# EAGLE design +5V_3.3V_+-2.5V_PowerSupply (EAGLE 7.2.0)
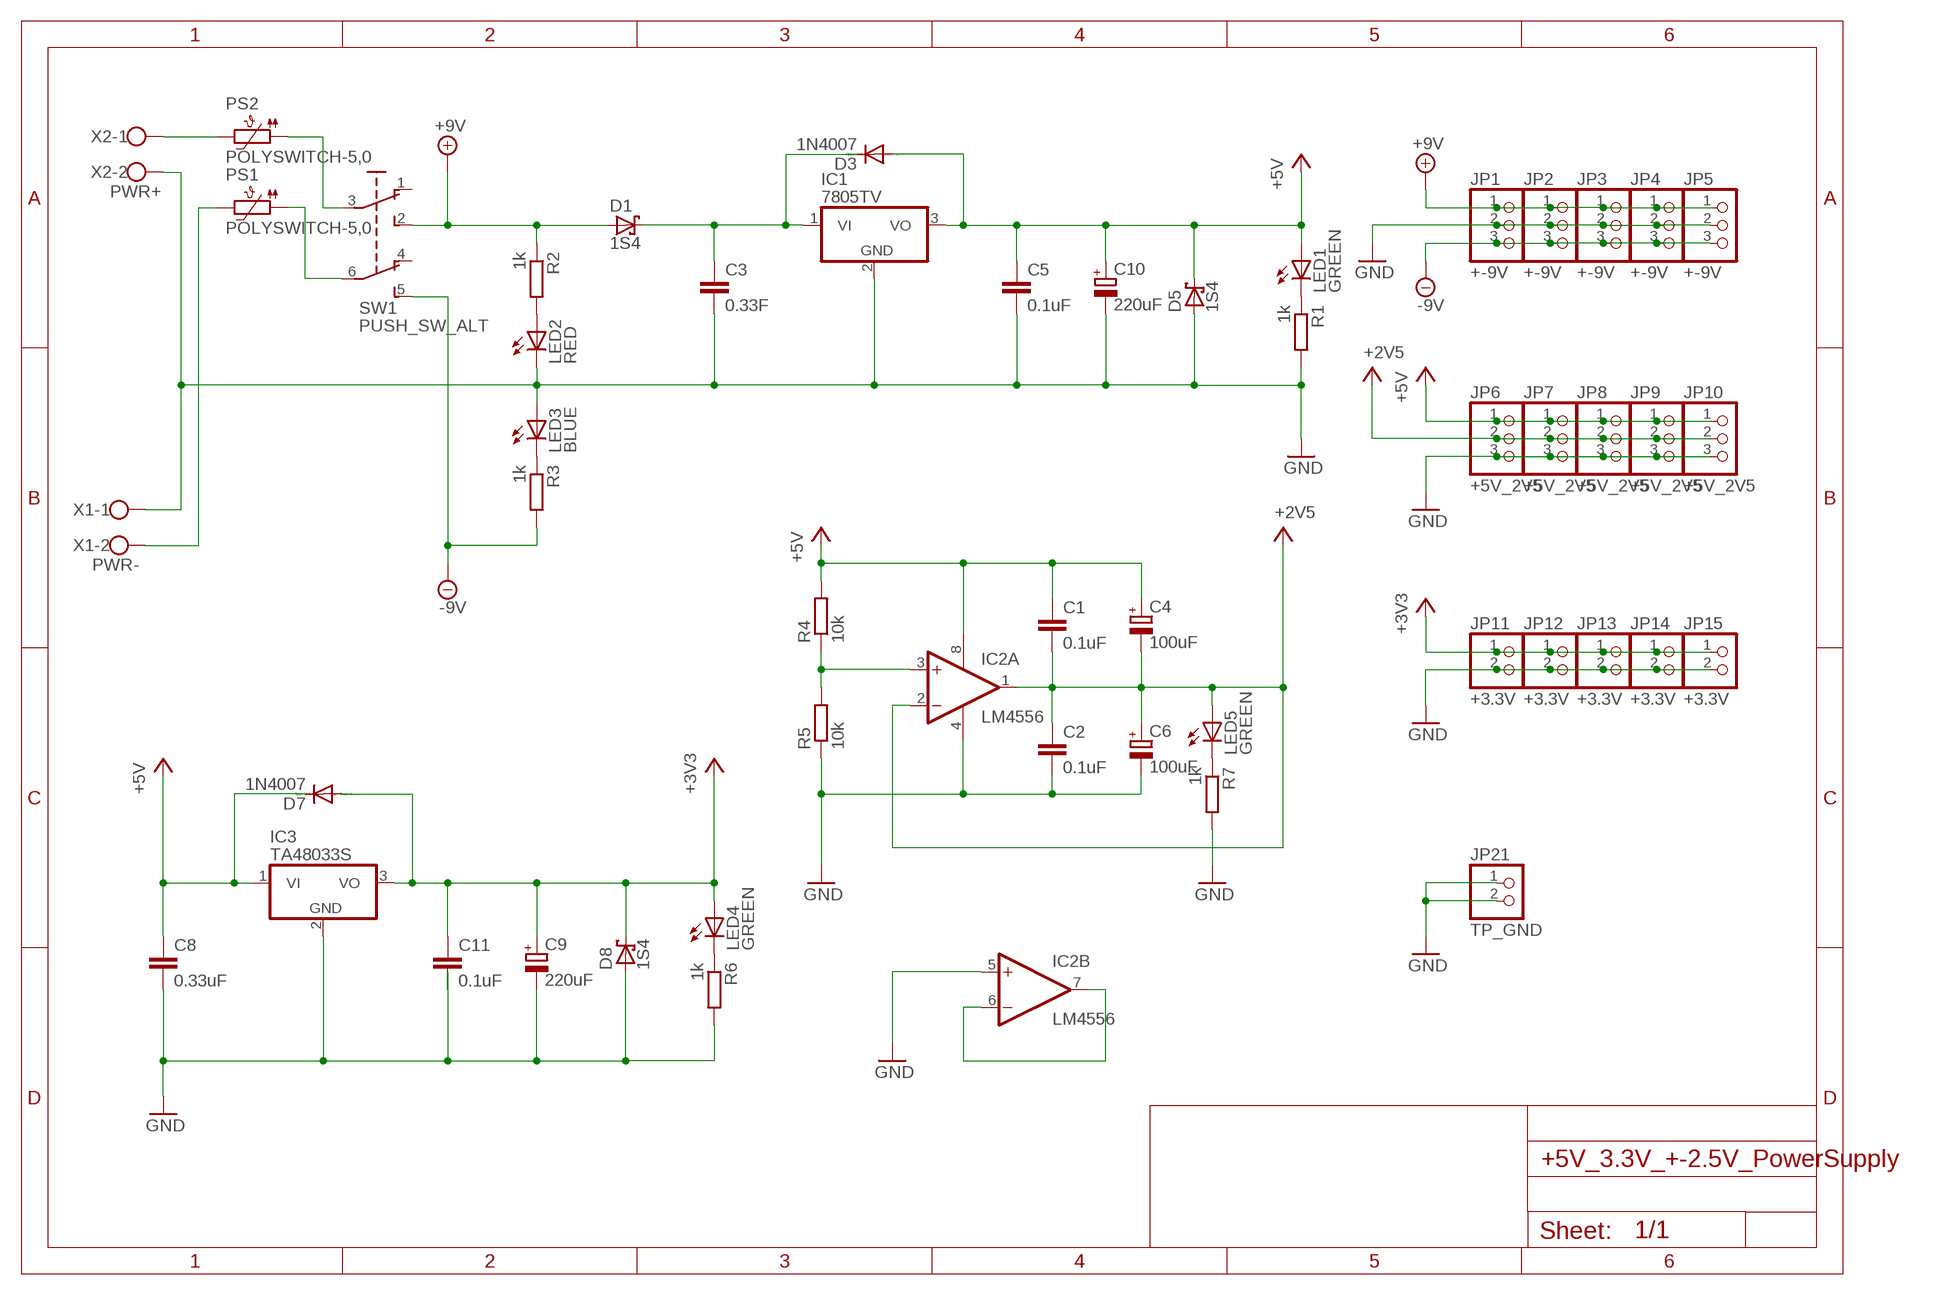
[diagram p0: schematic, sheet 1]

## Parts
C1  0.1uF  C-EU025-024X044  [C025-024X044]
C2  0.1uF  C-EU025-024X044  [C025-024X044]
C3  0.33F  C-EU050-025X075  [C050-025X075]
C4  100uF  CPOL-EUE2.5-6  [E2,5-6]
C5  0.1uF  C-EU025-024X044  [C025-024X044]
C6  100uF  CPOL-EUE2.5-6  [E2,5-6]
C8  0.33uF  C-EU050-025X075  [C050-025X075]
C9  220uF  CPOL-EUE2.5-7  [E2,5-7]
C10  220uF  CPOL-EUE2.5-7  [E2,5-7]
C11  0.1uF  C-EU025-024X044  [C025-024X044]
D1  1S4  SCHOTTKY-DIODEDO35-7  [DO35-7]
D3  1N4007  DIODE-D-7.5  [D-7.5]
D5  1S4  SCHOTTKY-DIODEDO35-7  [DO35-7]
D7  1N4007  DIODE-D-7.5  [D-7.5]
D8  1S4  SCHOTTKY-DIODEDO35-7  [DO35-7]
IC1  7805TV  [TO220V]
IC2  LM4556  LM4558N  [DIL08]
IC3  TA48033S  7805TV  [TO220V]
JP1  +-9V  PINHD-1X3  [1X03]
JP2  +-9V  PINHD-1X3  [1X03]
JP3  +-9V  PINHD-1X3  [1X03]
JP4  +-9V  PINHD-1X3  [1X03]
JP5  +-9V  PINHD-1X3  [1X03]
JP6  +5V_2V5  PINHD-1X3  [1X03]
JP7  +5V_2V5  PINHD-1X3  [1X03]
JP8  +5V_2V5  PINHD-1X3  [1X03]
JP9  +5V_2V5  PINHD-1X3  [1X03]
JP10  +5V_2V5  PINHD-1X3  [1X03]
JP11  +3.3V  PINHD-1X2  [1X02]
JP12  +3.3V  PINHD-1X2  [1X02]
JP13  +3.3V  PINHD-1X2  [1X02]
JP14  +3.3V  PINHD-1X2  [1X02]
JP15  +3.3V  PINHD-1X2  [1X02]
JP21  TP_GND  PINHD-1X2  [1X02]
LED1  GREEN  LED3MM  [LED3MM]
LED2  RED  LED3MM  [LED3MM]
LED3  BLUE  LED3MM  [LED3MM]
LED4  GREEN  LED3MM  [LED3MM]
LED5  GREEN  LED3MM  [LED3MM]
PS1  POLYSWITCH-5,0  [POLYSWITCH-5,0]
PS2  POLYSWITCH-5,0  [POLYSWITCH-5,0]
R1  1k  R-EU_0207/7  [0207/7]
R2  1k  R-EU_0207/7  [0207/7]
R3  1k  R-EU_0207/7  [0207/7]
R4  10k  R-EU_0207/7  [0207/7]
R5  10k  R-EU_0207/7  [0207/7]
R6  1k  R-EU_0207/7  [0207/7]
R7  1k  R-EU_0207/7  [0207/7]
SW1  PUSH_SW_ALT  [PUSH_SW_ALT]
X1  PWR-  W237-102  [W237-102]
X2  PWR+  W237-102  [W237-102]

## Nets
+3V3: C9.+ C11.1 D7.A D8.C IC3.3(VO) JP11.1 JP12.1 JP13.1 JP14.1 JP15.1 LED4.A
+5V: C1.1 C4.+ C5.1 C8.1 C10.+ D3.A D5.C D7.C IC1.3(VO) IC2.8(P:V+) IC3.1(VI) JP6.1 JP7.1 JP8.1 JP9.1 JP10.1 LED1.A R4.2
+9V: D1.A JP1.1 JP2.1 JP3.1 JP4.1 JP5.1 R2.1 SW1.2(S)
-9V: JP1.3 JP2.3 JP3.3 JP4.3 JP5.3 R3.2 SW1.5(S1)
GND: C2.2 C3.2 C5.2 C6.- C8.2 C9.- C10.- C11.2 D5.A D8.A IC1.2(GND) IC2.4(P:V-) IC2.5(B:+IN) IC3.2(GND) JP1.2 JP2.2 JP3.2 JP4.2 JP5.2 JP6.3 JP7.3 JP8.3 JP9.3 JP10.3 JP11.2 JP12.2 JP13.2 JP14.2 JP15.2 JP21.1 JP21.2 LED2.K(C) LED3.A R1.2 R5.1 R6.2 R7.2 X1.1 X2.2
N$1: PS2.2 X2.1
N$2: PS1.1 SW1.6(P1)
N$3: LED1.K(C) R1.1
N$4: LED2.A R2.2
N$5: C3.1 D1.C D3.C IC1.1(VI)
N$6: LED3.K(C) R3.1
N$7: IC2.3(A:+IN) R4.1 R5.2
N$8: LED5.K(C) R7.1
N$9: IC2.6(B:-IN) IC2.7(B:OUT)
N$10: PS1.2 X1.2
N$11: PS2.1 SW1.3(P)
N$12: LED4.K(C) R6.1
V+: C1.2 C2.1 C4.- C6.+ IC2.1(A:OUT) IC2.2(A:-IN) JP6.2 JP7.2 JP8.2 JP9.2 JP10.2 LED5.A ; supply symbol labelled +2V5
Unconnected: SW1.1(O) SW1.4(O1)

## Library data of the parts
C1-C3 C5 C8 C11 = rcl:C-EU: CAPACITOR, European symbol
C4 C6 C9 C10 = rcl:CPOL-EU: POLARIZED CAPACITOR, European symbol
D1 D5 D8 = diode:SCHOTTKY-DIODE: Schottky Diode
D3 D7 = diode:DIODE-: DIODE
IC1 IC3 = linear:78*: Positive VOLTAGE REGULATOR Source: http://cache.national.com/ds/LM/LM78L05.pdf http://www.fairchildsemi.com/ds/LM/LM7805.pdf
IC2 = linear:*4558: OP AMP
JP1-JP10 = pinhead:PINHD-1X3: PIN HEADER
JP11-JP15 JP21 = pinhead:PINHD-1X2: PIN HEADER
LED1-LED5 = led:LED: LED OSRAM: - CHIPLED LG R971, LG N971, LY N971, LG Q971, LY Q971, LO R971, LY R971 LH N974, LH R974 LS Q976, LO Q976, LY Q976 LO Q996 - Hyper CHIPLED LW Q18S LB Q993, LB Q99A, LB R99A - SideLED LS A670, LO A670, LY A670, LG A670, LP A670 LB A673, LV A673, LT A673, LW A673 LH A674 LY A675 LS A676, LA A676, LO A676, LY A676, LW A676 LS A679, LY A679, LG A679 - Hyper Micro SIDELED® LS Y876, LA Y876, LO Y876, LY Y876 LT Y87S - SmartLED LW L88C, LW L88S LB L89C, LB L89S, LG L890 LS L89K, LO L89K, LY L89K LS L896, LA L896, LO L896, LY L896 - TOPLED LS T670, LO T670, LY T670, LG T670, LP T670 LSG T670, LSP T670, LSY T670, LOP T670, LYG T670 LG T671, LOG T671, LSG T671 LB T673, LV T673, LT T673, LW T673 LH T674 LS T676, LA T676, LO T676, LY T676, LB T676, LH T676, LSB T676, LW T676 LB T67C, LV T67C, LT T67C, LS T67K, LO T67K, LY T67K, LW E67C LS E67B, LA E67B, LO E67B, LY E67B, LB E67C, LV E67C, LT E67C LW T67C LS T679, LY T679, LG T679 LS T770, LO T770, LY T770, LG T770, LP T770 LB T773, LV T773, LT T773, LW T773 LH T774 LS E675, LA E675, LY E675, LS T675 LS T776, LA T776, LO T776, LY T776, LB T776 LHGB T686 LT T68C, LB T68C - Hyper Mini TOPLED® LB M676 - Mini TOPLED Santana® LG M470 LS M47K, LO M47K, LY M47K Source: http://www.osram.convergy.de LUXEON: - LUMILED® LXK2-PW12-R00, LXK2-PW12-S00, LXK2-PW14-U00, LXK2-PW14-V00 LXK2-PM12-R00, LXK2-PM12-S00, LXK2-PM14-U00 LXK2-PE12-Q00, LXK2-PE12-R00, LXK2-PE12-S00, LXK2-PE14-T00, LXK2-PE14-U00 LXK2-PB12-K00, LXK2-PB12-L00, LXK2-PB12-M00, LXK2-PB14-N00, LXK2-PB14-P00, LXK2-PB14-Q00 LXK2-PR12-L00, LXK2-PR12-M00, LXK2-PR14-Q00, LXK2-PR14-R00 LXK2-PD12-Q00, LXK2-PD12-R00, LXK2-PD12-S00 LXK2-PH12-R00, LXK2-PH12-S00 LXK2-PL12-P00, LXK2-PL12-Q00, LXK2-PL12-R00 Source: www.luxeon.com KINGBRIGHT: KA-3528ASYC Source: www.kingbright.com
PS1 PS2 = mylib2:POLYSWITCH-5,0
R1-R7 = rcl:R-EU_: RESISTOR, European symbol
SW1 = mylib2:PUSH_SW_ALT
X1 X2 = con-wago-500:W237-102: WAGO SCREW CLAMP; MPN: 237-102; OC_FARNELL: unknown; OC_NEWARK: 70K9898

## Board
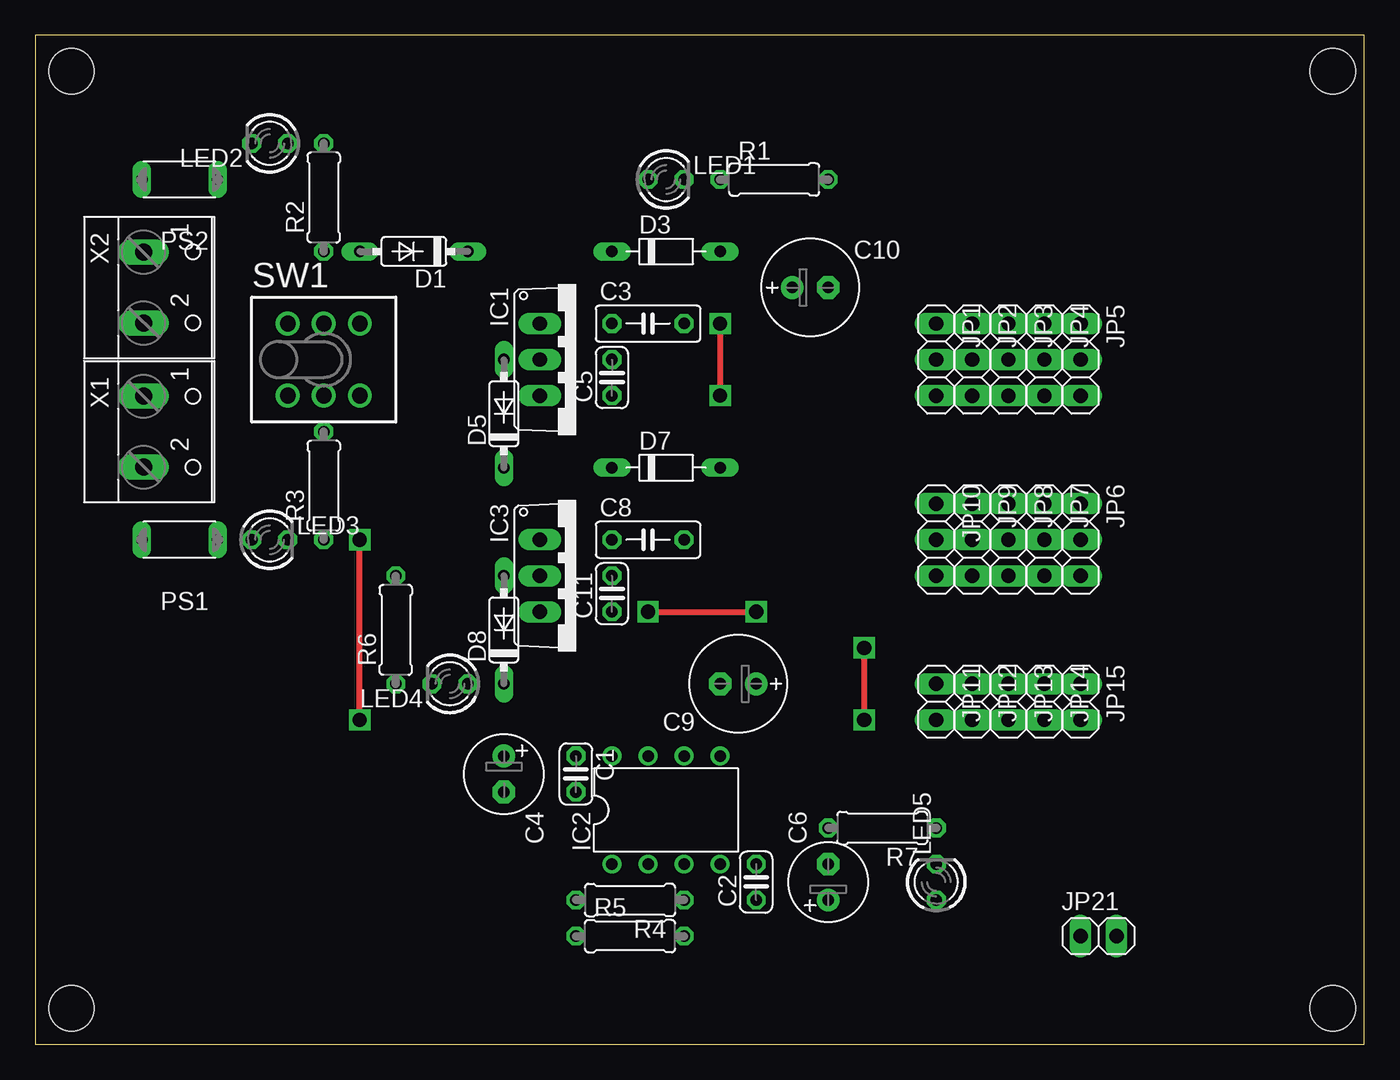
[diagram p1: board, top side]
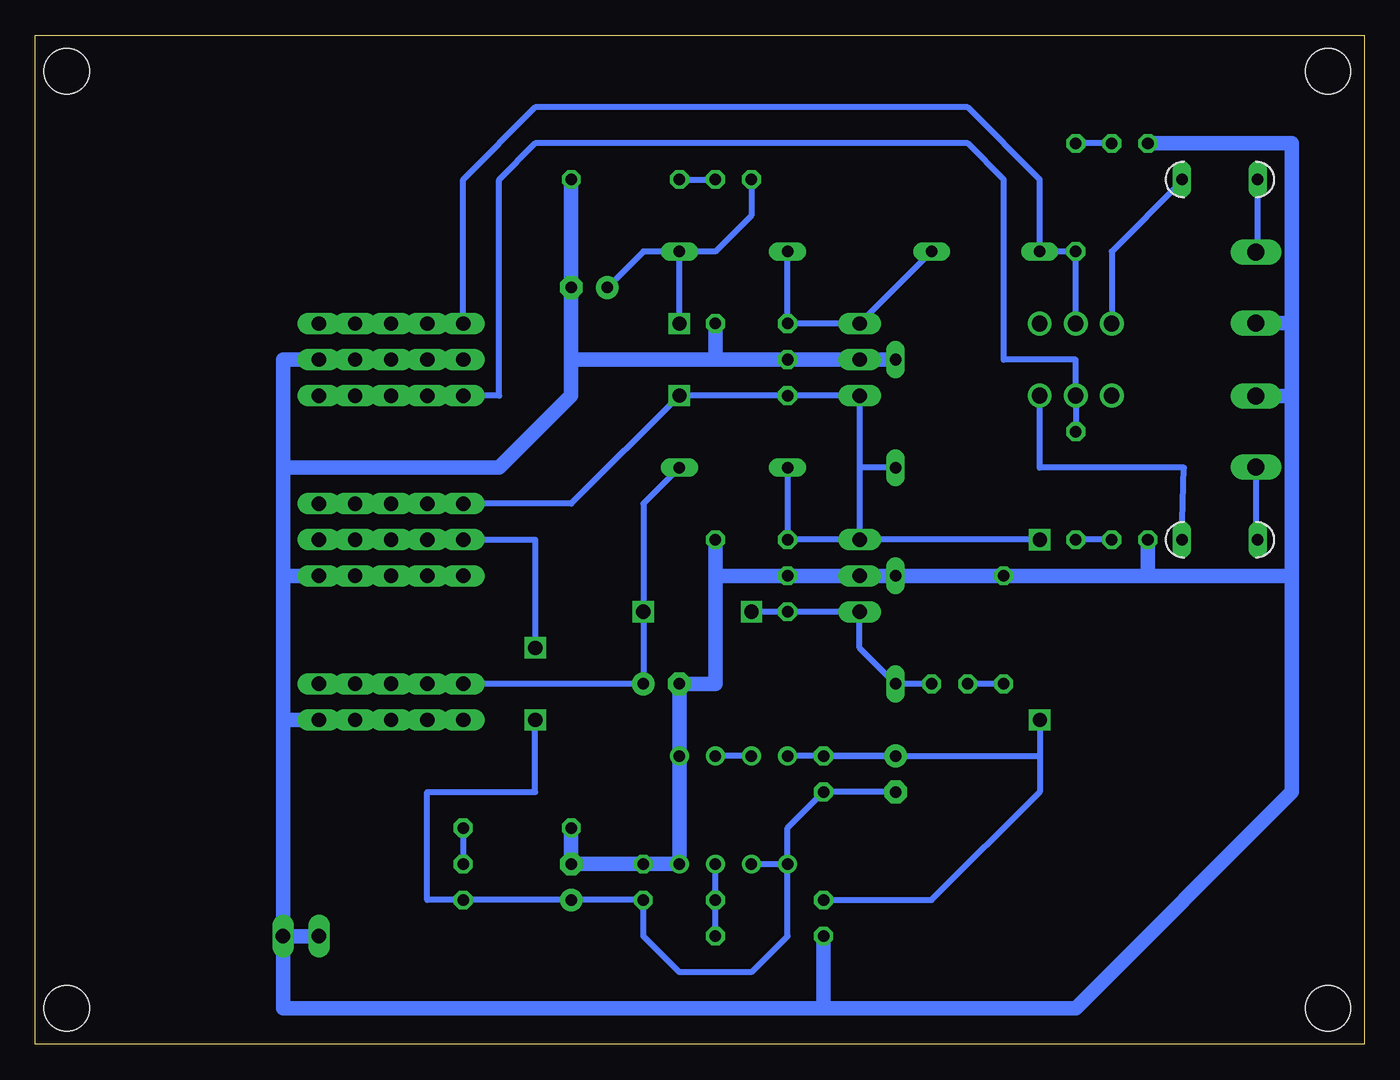
[diagram p2: board, bottom side, seen from below]

Size 93.65 x 71.11 mm. Coordinates in mm from the lower left corner, seen from the top.
Outline: 0,0 93.65,0 93.65,71.11 0,71.11 0,0
Copper layers (1*16): Top 0.035mm / dielectric 1.5mm / Bottom 0.035mm
Design rules "default": minimum track width 10mil, minimum drill 24mil, track to track 8mil, track to pad 8mil, pad to pad 8mil, via to via 8mil, smd to smd 8mil, copper to edge 40mil, drill to drill 8mil, minimum pad ring 10mil, minimum via ring 8mil, stop-mask expansion 4mil, vias tented up to drill 0mil, thermal gap 10mil
Holes 3.2 mm at 2.54,2.54 91.44,2.54 91.44,68.58 2.54,68.58

### Footprints (pad centres in the part's own frame; a part is rotated, then mirrored left to right if it is on the bottom)
C025-024X044 = drill 0.813 octagon: 1 -1.27,0; 2 1.27,0
C050-025X075 = drill 0.813 octagon: 1 -2.54,0; 2 2.54,0
E2,5-6 = drill 0.813 pad 1.6: + -1.27,0 | drill 0.813 pad 1.6 octagon: - 1.27,0
E2,5-7 = drill 0.813 pad 1.6: + -1.27,0 | drill 0.813 pad 1.6 octagon: - 1.27,0
DO35-7 = drill 0.813 long: A 3.81,0; C -3.81,0
D-7.5 = drill 0.813 long: A 3.81,0; C -3.81,0
TO220V = drill 1.016 long: 1 -2.54,-2.54; 2 0,-2.54; 3 2.54,-2.54
DIL08 = drill 0.813 pad 1.27: 1 -3.81,-3.81; 2 -1.27,-3.81; 3 1.27,-3.81; 4 3.81,-3.81; 5 3.81,3.81; 6 1.27,3.81; 7 -1.27,3.81; 8 -3.81,3.81
1X03 = drill 1.016 long: 1 -2.54,0; 2 0,0; 3 2.54,0
1X02 = drill 1.016 long: 1 -1.27,0; 2 1.27,0
LED3MM = drill 0.813 octagon: A -1.27,0; K 1.27,0
POLYSWITCH-5,0 = drill 0.813 long: 1 -2.667,0; 2 2.667,0
0207/7 = drill 0.813 octagon: 1 -3.81,0; 2 3.81,0
PUSH_SW_ALT = drill 1.1 pad 1.676: 1 2.54,2.54; 2 0,2.54; 3 -2.54,2.54; 4 -2.54,-2.54; 5 0,-2.54; 6 2.54,-2.54
W237-102 = drill 1.194 long: 1 -2.5,-1.27; 2 2.5,-1.27

### Placement (x,y rotation side)
C1  38.1,19.05 270 top
C2  50.8,11.43 90 top
C3  43.18,50.8 0 top
C4  33.02,19.05 270 top
C5  40.64,46.99 90 top
C6  55.88,11.43 90 top
C8  43.18,35.56 0 top
C9  49.53,25.4 180 top
C10  54.61,53.34 0 top
C11  40.64,31.75 90 top
D1  26.67,55.88 180 top
D3  44.45,55.88 0 top
D5  33.02,44.45 90 top
D7  44.45,40.64 0 top
D8  33.02,29.21 90 top
IC1  38.1,48.26 270 top
IC2  44.45,16.51 0 top
IC3  38.1,33.02 270 top
JP1  63.5,48.26 270 top
JP2  66.04,48.26 270 top
JP3  68.58,48.26 270 top
JP4  71.12,48.26 270 top
JP5  73.66,48.26 270 top
JP6  73.66,35.56 270 top
JP7  71.12,35.56 270 top
JP8  68.58,35.56 270 top
JP9  66.04,35.56 270 top
JP10  63.5,35.56 270 top
JP11  63.5,24.13 270 top
JP12  66.04,24.13 270 top
JP13  68.58,24.13 270 top
JP14  71.12,24.13 270 top
JP15  73.66,24.13 270 top
JP21  74.93,7.62 0 top
LED1  44.45,60.96 0 top
LED2  16.51,63.5 180 top
LED3  16.51,35.56 0 top
LED4  29.21,25.4 180 top
LED5  63.5,11.43 90 top
PS1  10.16,35.56 180 top
PS2  10.16,60.96 180 top
R1  52.07,60.96 0 top
R2  20.32,59.69 90 top
R3  20.32,39.37 90 top
R4  41.91,10.16 180 top
R5  41.91,7.62 0 top
R6  25.4,29.21 90 top
R7  59.69,15.24 180 top
SW1  20.32,48.26 0 top
X1  8.89,43.18 270 top
X2  8.89,53.34 270 top

### Tracks (layer width: path | path; a pad name or v marks a point on that pad's centre or on a via)
+3V3  (via drill 1)
  Top 0.406: v43.18,30.48 v50.8,30.48
  Bottom 0.406: D7.A 50.8,38.1 v50.8,30.48 C9.+ JP11.1 JP12.1 JP13.1 JP14.1 JP15.1 | LED4.A D8.C 35.56,27.94 IC3.3 C11.1 v43.18,30.48
+5V  (via drill 1)
  Top 0.406: v22.86,22.86 v22.86,35.56 | v48.26,50.8 v48.26,45.72
  Bottom 0.406: 35.56,40.64 IC1.3 C5.1 v48.26,45.72 55.88,38.1 JP10.1 JP9.1 JP8.1 JP7.1 JP6.1 | 35.56,40.64 IC3.1 | D5.C 35.56,40.64 | IC3.1 C8.1 D7.C | C1.1 IC2.8 | C4.+ C1.1 | v22.86,35.56 IC3.1 | v48.26,50.8 D3.A | LED1.A 43.18,58.42 45.72,55.88 D3.A | D3.A 50.8,55.88 C10.+ | R4.2 30.48,10.16 22.86,17.78 22.86,20.32 | v22.86,22.86 22.86,20.32 | C1.1 22.86,20.32
+9V
  Bottom 0.406: SW1.2 R2.1 D1.A 22.86,60.96 27.94,66.04 58.42,66.04 63.5,60.96 JP1.1 JP2.1 JP3.1 JP4.1 JP5.1
-9V
  Bottom 0.406: R3.2 SW1.5 20.32,48.26 25.4,48.26 25.4,60.96 27.94,63.5 58.42,63.5 60.96,60.96 60.96,45.72 JP1.3 JP2.3 JP3.3 JP4.3 JP5.3
GND
  Bottom 0.406: 5.12,50.84 5.08,50.8 | 5.12,45.68 5.08,45.72
  Bottom 1.016: X2.2 5.12,50.84 | LED2.K 5.08,63.5 5.08,50.8 5.08,45.72 5.08,33.02 | X1.1 5.12,45.68 | D5.A IC1.2 C5.2 45.72,48.26 | 45.72,33.02 C11.2 IC3.2 D8.A R6.2 15.24,33.02 | 45.72,33.02 C8.2 | JP1.2 JP2.2 JP3.2 JP4.2 JP5.2 76.2,48.26 76.2,40.64 | 76.2,40.64 76.2,33.02 | 76.2,33.02 76.2,22.86 | 38.1,2.54 76.2,2.54 JP21.2 | 38.1,2.54 20.32,2.54 5.08,17.78 5.08,33.02 | JP21.1 JP21.2 | R5.1 38.1,2.54 | R7.2 C6.- C2.2 IC2.4 IC2.5 C9.- 45.72,25.4 45.72,33.02 | R1.2 C10.- 55.88,48.26 | 55.88,48.26 55.88,45.72 60.96,40.64 76.2,40.64 | 45.72,48.26 55.88,48.26 | C3.2 45.72,48.26 | 15.24,33.02 5.08,33.02 | LED3.A 15.24,33.02 | 76.2,33.02 JP6.3 JP7.3 JP8.3 JP9.3 JP10.3 | 76.2,22.86 JP15.2 JP14.2 JP13.2 JP12.2 JP11.2 | JP21.2 76.2,22.86
N$1
  Bottom 0.406: X2.1 7.49,55.84 PS2.2
N$2
  Bottom 0.406: SW1.6 22.86,40.64 12.7,40.64 12.83,35.69 PS1.1
N$3
  Bottom 0.406: R1.1 LED1.K
N$4
  Bottom 0.406: LED2.A R2.2
N$5
  Bottom 0.406: D3.C C3.1 IC1.1 D1.C
N$6
  Bottom 0.406: LED3.K R3.1
N$7
  Bottom 0.406: R5.2 R4.1 IC2.3
N$8
  Bottom 0.406: R7.1 LED5.K
N$9
  Bottom 0.406: IC2.7 IC2.6
N$10
  Bottom 0.406: X1.2 7.62,35.56 PS1.2
N$11
  Bottom 0.406: PS2.1 12.83,60.83 17.78,55.88 SW1.3
N$12
  Bottom 0.406: R6.1 LED4.K
V+  (via drill 1)
  Top 0.406: v58.42,22.86 v58.42,27.94
  Bottom 0.406: IC2.2 IC2.1 | C4.- C1.2 40.64,15.24 IC2.1 | JP6.2 JP7.2 JP8.2 JP9.2 JP10.2 58.42,35.56 v58.42,27.94 | v58.42,22.86 58.42,17.78 66.04,17.78 66.04,10.16 LED5.A C6.+ C2.1 50.8,7.62 48.26,5.08 43.18,5.08 40.64,7.62 IC2.1